# EAGLE schematic alarm_clock (EAGLE 7.7.0)
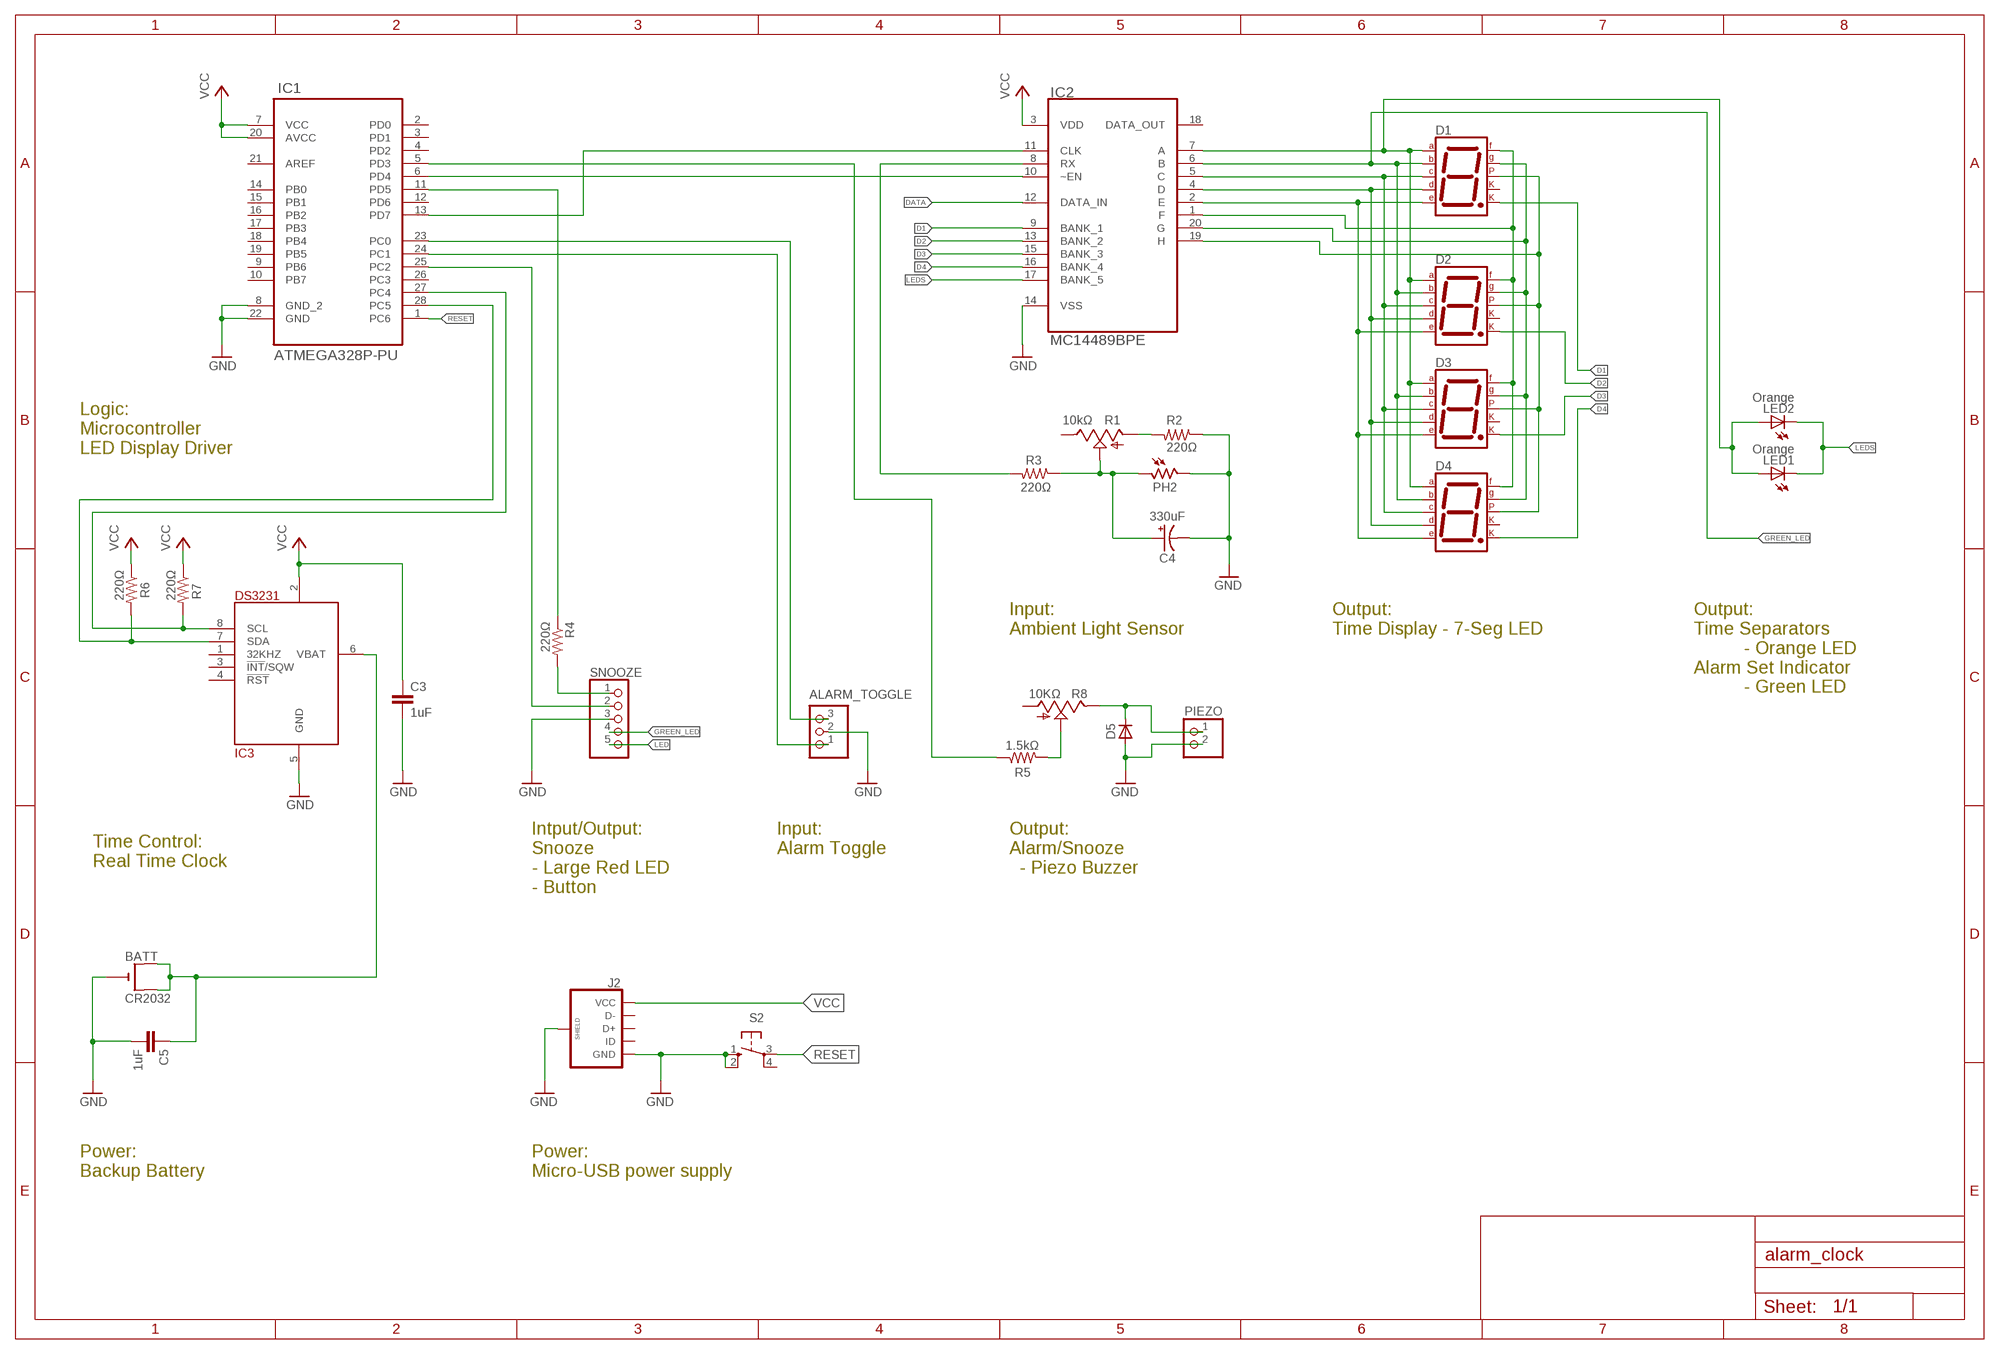
[diagram p0: schematic, sheet 1]

## Parts
ALARM_TOGGLE  PINHD-1X3/90  [1X03/90]
BATT  CR2032  CR2032THM  [CR2032-THRU]
C3  1uF  C-EU025-024X044  [C025-024X044]
C4  330uF  CPOL-USE2.5-6  [E2,5-6]
C5  1uF  C-EU025-024X044  [C025-024X044]
D1  7SEG-CK  [7SEG-13]
D2  7SEG-CK  [7SEG-13]
D3  7SEG-CK  [7SEG-13]
D4  7SEG-CK  [7SEG-13]
D5  1N4148DO35-7  [DO35-7]
IC1  ATMEGA328P-PU  [DIP254P762X457-28]
IC2  MC14489BPE  [DIP254P762X457-20]
IC3  DS3231  [DS3231-8_SO]
J2  USB_MICROB_PLUG-PTH2  [MICRO-B-TH]
LED1  Orange  LED3MM  [LED3MM]
LED2  Orange  LED3MM  [LED3MM]
PH2  A1050_09  [T0-46-A10XX]
PIEZO  PINHD-1X2/90  [1X02/90]
R1  10kΩ  TRIM_US-CA6V  [CA6V]
R2  220Ω  R-US_0207/7  [0207/7]
R3  220Ω  R-US_0207/7  [0207/7]
R4  220Ω  R-US_0207/7  [0207/7]
R5  1.5kΩ  R-US_0207/7  [0207/7]
R6  220Ω  R-US_0207/7  [0207/7]
R7  220Ω  R-US_0207/7  [0207/7]
R8  10KΩ  TRIM_US-CA6V  [CA6V]
S2  10-XX  [B3F-10XX]
SNOOZE  PINHD-1X5/90  [1X05/90]

## Nets
A: D1.7(A) D2.7(A) D3.7(A) D4.7(A) IC2.7(A) LED1.A LED2.A
C: D1.4(C) D2.4(C) D3.4(C) D4.4(C) IC2.5(C)
CLK: IC1.13(PD7) IC2.11(CLK)
D: D1.2(D) D2.2(D) D3.2(D) D4.2(D) IC2.4(D)
D1: D1.8(CK2) IC2.9(BANK_1)
D2: D2.8(CK2) IC2.13(BANK_2)
D3: D3.8(CK2) IC2.15(BANK_3)
D4: D4.8(CK2) IC2.16(BANK_4)
DATA: IC2.12(DATA_IN)
E: D1.1(E) D2.1(E) D3.1(E) D4.1(E) IC2.2(E)
EN: IC1.6(PD4) IC2.10(~EN)
F: D1.9(F) D2.9(F) D3.9(F) D4.9(F) IC2.1(F)
G: D1.10(G) D2.10(G) D3.10(G) D4.10(G) IC2.20(G)
GND: ALARM_TOGGLE.2 BATT.- C3.2 C4.- C5.2 D5.A IC1.8(GND_2) IC1.22(GND) IC2.14(VSS) IC3.5(GND) J2.5(GND) J2.P$1(SHIELD) PH2.2 PIEZO.2 R2.1 S2.1(S) S2.2(S1) SNOOZE.3
GREEN_LED: D1.6(B) D2.6(B) D3.6(B) D4.6(B) IC2.6(B) SNOOZE.4
LED: SNOOZE.5
LEDS: IC2.17(BANK_5) LED1.K(C) LED2.K(C)
N$1: R1.A R2.2
N$2: R4.2 SNOOZE.1
N$4: R5.2 R8.S
N$5: ALARM_TOGGLE.3 IC1.23(PC0)
N$6: ALARM_TOGGLE.1 IC1.24(PC1)
N$9: IC1.25(PC2) SNOOZE.2
N$14: D5.C PIEZO.1 R8.E
N$21: C4.+ PH2.1 R1.S R3.1
P: D1.5(DP) D2.5(DP) D3.5(DP) D4.5(DP) IC2.19(H)
PZ: IC1.5(PD3) R5.1
RESET: IC1.1(PC6) S2.3(P)
RX: IC2.8(RX) R3.2
SCL: IC1.27(PC4) IC3.8(SCL) R7.2
SDA: IC1.28(PC5) IC3.7(SDA) R6.2
SNZ: IC1.11(PD5) R4.1
VBAT: BATT.+1(+) BATT.+2(+1) C5.1 IC3.6(VBAT)
VCC: C3.1 IC1.7(VCC) IC1.20(AVCC) IC2.3(VDD) IC3.2(VCC) J2.1(VCC) R6.1 R7.1
Unconnected: D1.3(CK1) D2.3(CK1) D3.3(CK1) D4.3(CK1) IC1.2(PD0) IC1.3(PD1) IC1.4(PD2) IC1.9(PB6) IC1.10(PB7) IC1.12(PD6) IC1.14(PB0) IC1.15(PB1) IC1.16(PB2) IC1.17(PB3) IC1.18(PB4) IC1.19(PB5) IC1.21(AREF) IC1.26(PC3) IC2.18(DATA_OUT) IC3.1(32KHZ) IC3.3(!INT!/SQW) IC3.4(!RST!) J2.2(D-) J2.3(D+) J2.4(ID) R1.E R8.A S2.4(P1)

## Notes on the sheet
- Logic:
  Microcontroller
  LED Display Driver
- Input:
  Ambient Light Sensor
- Output:
  Time Display - 7-Seg LED
- Output:
  Time Separators
            - Orange LED
  Alarm Set Indicator
            - Green LED
- Intput/Output:
  Snooze
  - Large Red LED
  - Button
- Input:
  Alarm Toggle
- Output:
  Alarm/Snooze
    - Piezo Buzzer
- Time Control:
  Real Time Clock
- Power:
  Backup Battery
- Power:
  Micro-USB power supply

## Library data of the parts
ALARM_TOGGLE = pinhead:PINHD-1X3: PIN HEADER
BATT = adafruit:CR2032; MF: KEYSTONE; MPN: 1066..; OC_FARNELL: 2293258
C3 C5 = rcl:C-EU: CAPACITOR, European symbol; OC_FARNELL: unknown
C4 = rcl:CPOL-US: POLARIZED CAPACITOR, American symbol; OC_FARNELL: unknown
D1-D4 = special:7SEG-CK: 7-segment DISPLAY single cathode, 13 mm; OC_FARNELL: unknown
D5 = diode:1N4148: DIODE high speed (Philips); OC_FARNELL: unknown
IC1 = Atmel_By_element14_Batch_1-00:ATMEGA328P-PU: 8-bit Microcontroller with In-System Programmable Flash; MF: ATMEL; MPN: ATMEGA328P-PU; OC_FARNELL: 1715487; OC_NEWARK: 15R0268; PACKAGE: PDIP-28; SUPPLIER: Atmel
IC2 = MC14489BPE:MC14489BPE: LED DISPLAY/LAMP DRIVER; MPN: MC14489BPE; OC_FARNELL: 1457137; OC_NEWARK: 62K4874; PACKAGE: DIP-20; SUPPLIER: FREESCALE SEMICONDUCTOR
IC3 = ds3231:DS3231
J2 = SparkFun-Connectors:USB_MICROB_PLUG: USB Micro-B connectors Some male, some female. Watch your step!
LED1 LED2 = led:LED: LED OSRAM: - CHIPLED LG R971, LG N971, LY N971, LG Q971, LY Q971, LO R971, LY R971 LH N974, LH R974 LS Q976, LO Q976, LY Q976 LO Q996 - Hyper CHIPLED LW Q18S LB Q993, LB Q99A, LB R99A - SideLED LS A670, LO A670, LY A670, LG A670, LP A670 LB A673, LV A673, LT A673, LW A673 LH A674 LY A675 LS A676, LA A676, LO A676, LY A676, LW A676 LS A679, LY A679, LG A679 - Hyper Micro SIDELED® LS Y876, LA Y876, LO Y876, LY Y876 LT Y87S - SmartLED LW L88C, LW L88S LB L89C, LB L89S, LG L890 LS L89K, LO L89K, LY L89K LS L896, LA L896, LO L896, LY L896 - TOPLED LS T670, LO T670, LY T670, LG T670, LP T670 LSG T670, LSP T670, LSY T670, LOP T670, LYG T670 LG T671, LOG T671, LSG T671 LB T673, LV T673, LT T673, LW T673 LH T674 LS T676, LA T676, LO T676, LY T676, LB T676, LH T676, LSB T676, LW T676 LB T67C, LV T67C, LT T67C, LS T67K, LO T67K, LY T67K, LW E67C LS E67B, LA E67B, LO E67B, LY E67B, LB E67C, LV E67C, LT E67C LW T67C LS T679, LY T679, LG T679 LS T770, LO T770, LY T770, LG T770, LP T770 LB T773, LV T773, LT T773, LW T773 LH T774 LS E675, LA E675, LY E675, LS T675 LS T776, LA T776, LO T776, LY T776, LB T776 LHGB T686 LT T68C, LB T68C - Hyper Mini TOPLED® LB M676 - Mini TOPLED Santana® LG M470 LS M47K, LO M47K, LY M47K Source: http://www.osram.convergy.de LUXEON: - LUMILED® LXK2-PW12-R00, LXK2-PW12-S00, LXK2-PW14-U00, LXK2-PW14-V00 LXK2-PM12-R00, LXK2-PM12-S00, LXK2-PM14-U00 LXK2-PE12-Q00, LXK2-PE12-R00, LXK2-PE12-S00, LXK2-PE14-T00, LXK2-PE14-U00 LXK2-PB12-K00, LXK2-PB12-L00, LXK2-PB12-M00, LXK2-PB14-N00, LXK2-PB14-P00, LXK2-PB14-Q00 LXK2-PR12-L00, LXK2-PR12-M00, LXK2-PR14-Q00, LXK2-PR14-R00 LXK2-PD12-Q00, LXK2-PD12-R00, LXK2-PD12-S00 LXK2-PH12-R00, LXK2-PH12-S00 LXK2-PL12-P00, LXK2-PL12-Q00, LXK2-PL12-R00 Source: www.luxeon.com KINGBRIGHT: KA-3528ASYC Source: www.kingbright.com; MF: MULTICOMP; MPN: MCL053HAD/12; OC_FARNELL: 1581228
PH2 = photo-elements:A10: Sensor Robust Light Sensing Applications Outdoor Light Sensing Application Source: http://optoelectronics.perkinelmer.com/content/Datasheets/DTS_PhotocellsA1050.pdf; OC_FARNELL: unknown
PIEZO = pinhead:PINHD-1X2: PIN HEADER; OC_FARNELL: unknown
R1 R8 = pot:TRIM_US-: POTENTIOMETER; OC_FARNELL: unknown
R2-R7 = rcl:R-US_: RESISTOR, American symbol; OC_FARNELL: unknown
S2 = switch-omron:10-XX: OMRON SWITCH; MPN: B3F-1000; OC_FARNELL: 176432; OC_NEWARK: 36M3542
SNOOZE = pinhead:PINHD-1X5: PIN HEADER